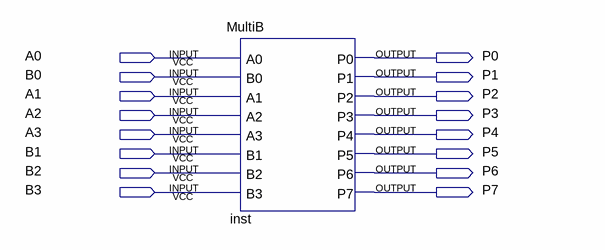
[diagram p0: schematic sheet]
// Quartus schematic Multiplicador.bdf as structural Verilog: 1 symbols, 16 pins
module Multiplicador (
  input  A0,
  input  B0,
  input  A1,
  input  A2,
  input  A3,
  input  B1,
  input  B2,
  input  B3,
  output P0,
  output P1,
  output P2,
  output P3,
  output P4,
  output P5,
  output P6,
  output P7
);

  MultiB inst (
    .A0(A0), .B0(B0), .A1(A1), .A2(A2), .A3(A3), .B1(B1), .B2(B2), .B3(B3), .P0(P0), .P1(P1), .P2(P2),
    .P3(P3), .P4(P4), .P5(P5), .P6(P6), .P7(P7));
endmodule
